# Altium schematic sheet esp32.SchDoc
size A4; SheetNumber: 1; SheetTotal: 5
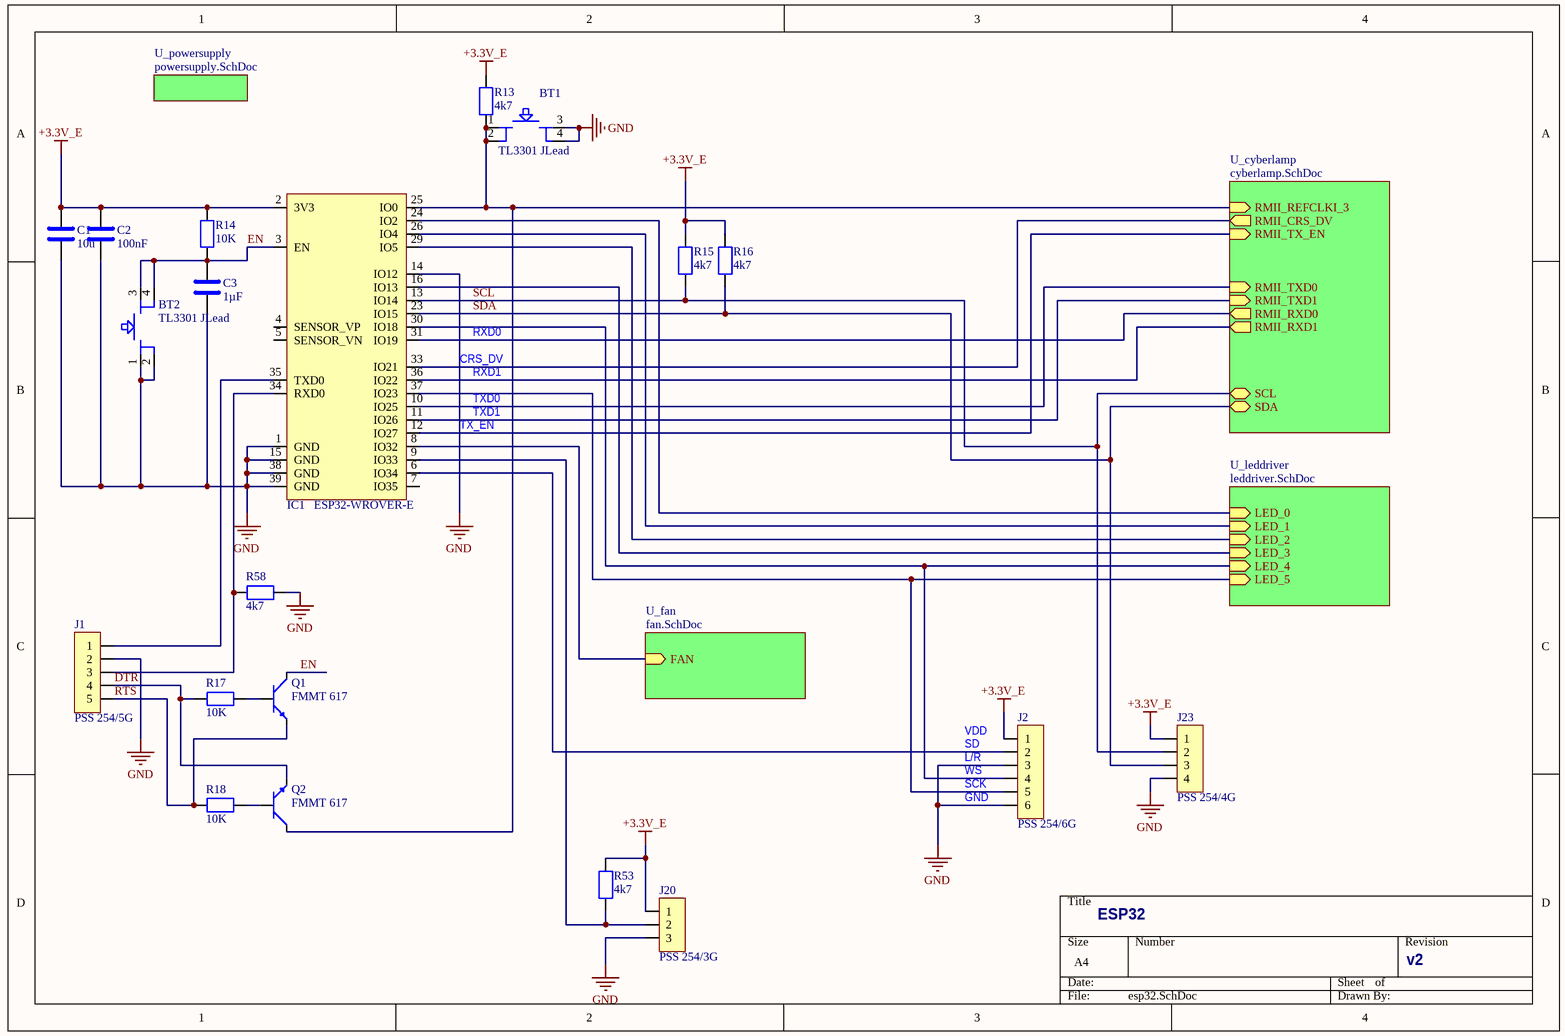
[diagram p0: esp32.SchDoc]

## Parts
BT1  TL3301 JLead  [TL3301_Jlead]
BT2  TL3301 JLead  [TL3301_Jlead]
C1  value 10u  [1210]  (hidden comment: 10uF 63V X7R 1210)
C2  value 100nF  [0603]  (hidden comment: 100nF 50V MLCC 0603)
C3  value 1µF  [0805]  (hidden comment: 1µF 25V MLCC 0805)
IC1  ESP32-WROVER-E  [ESP32-WROVER-I]
J1  PSS 254/5G  [PSS 5pol]
J2  PSS 254/6G  [PSS 6pol]
J20  PSS 254/3G  [PSS 3pol]
J23  PSS 254/4G  [PSS 4pol]
Q1  FMMT 617  [SOT-23]
Q2  FMMT 617  [SOT-23]
R13  value 4k7  [res0603]  (hidden comment: 4k7 100mW 0603)
R14  value 10K  [res0603]  (hidden comment: 10K 100mW 0603)
R15  value 4k7  [res0603]  (hidden comment: 4k7 100mW 0603)
R16  value 4k7  [res0603]  (hidden comment: 4k7 100mW 0603)
R17  value 10K  [res0603]  (hidden comment: 10K 100mW 0603)
R18  value 10K  [res0603]  (hidden comment: 10K 100mW 0603)
R53  value 4k7  [res0603]  (hidden comment: 4k7 100mW 0603)
R58  value 4k7  [res0603]  (hidden comment: 4k7 100mW 0603)

## Sub-sheets
U_cyberlamp = cyberlamp.SchDoc: RMII_REFCLKI_3 (in), RMII_TX_EN (in), RMII_TXD1 (in), RMII_TXD0 (in), RMII_CRS_DV (out), RMII_RXD1 (out), RMII_RXD0 (out), SCL (bidir), SDA (bidir)
U_fan = fan.SchDoc: FAN (in)
U_leddriver = leddriver.SchDoc: LED_0 (in), LED_1 (in), LED_2 (in), LED_3 (in), LED_4 (in), LED_5 (in)
U_powersupply = powersupply.SchDoc: no entries

## Nets
+3.3V_E: C1.1 C2.1 IC1.2(3V3) J2.1 J20.1 J23.1 R13.2 R14.2 R15.2 R16.2 R53.2
GND: BT1.3 BT1.4 BT2.1 BT2.2 C1.2 C2.2 C3.2 IC1.1(GND) IC1.14(IO12) IC1.15(GND) IC1.38(GND) IC1.39(GND) J1.2 J2.3 J2.6 J20.3 J23.4 R58.1
DTR: J1.4 Q2.2 R17.2
EN: BT2.3 BT2.4 C3.1 IC1.3(EN) Q1.3 R14.1
RTS: J1.5 Q1.2 R18.2
SCL: IC1.13(IO14) J23.2 R15.1 ; sheet U_cyberlamp/SCL
SDA: IC1.23(IO15) J23.3 R16.1 ; sheet U_cyberlamp/SDA
NetBT1_1: BT1.1 BT1.2 IC1.25(IO0) Q2.3 R13.1 ; sheet U_cyberlamp/RMII_REFCLKI_3
NetIC1_6: IC1.6(IO34) J2.2
NetIC1_8: IC1.8(IO32) ; sheet U_fan/FAN
NetIC1_9: IC1.9(IO33) J20.2 R53.1
NetIC1_10: IC1.10(IO25) ; sheet U_cyberlamp/RMII_TXD0
NetIC1_11: IC1.11(IO26) ; sheet U_cyberlamp/RMII_TXD1
NetIC1_12: IC1.12(IO27) ; sheet U_cyberlamp/RMII_TX_EN
NetIC1_16: IC1.16(IO13) ; sheet U_leddriver/LED_3
NetIC1_24: IC1.24(IO2) ; sheet U_leddriver/LED_0
NetIC1_26: IC1.26(IO4) ; sheet U_leddriver/LED_1
NetIC1_29: IC1.29(IO5) ; sheet U_leddriver/LED_2
NetIC1_30: IC1.30(IO18) J2.4 ; sheet U_leddriver/LED_4
NetIC1_31: IC1.31(IO19) ; sheet U_cyberlamp/RMII_RXD0
NetIC1_33: IC1.33(IO21) ; sheet U_cyberlamp/RMII_CRS_DV
NetIC1_34: IC1.34(RXD0) J1.3 R58.2
NetIC1_35: IC1.35(TXD0) J1.1
NetIC1_36: IC1.36(IO22) ; sheet U_cyberlamp/RMII_RXD1
NetIC1_37: IC1.37(IO23) J2.5 ; sheet U_leddriver/LED_5
NetQ1_1: Q1.1 R17.1
NetQ2_1: Q2.1 R18.1

Not connected (* = marked no-connect by the designer): IC1 4(SENSOR_VP) 5(SENSOR_VN) 7(IO35)

## Notes on the sheet
- (near IC1) CRS_DV
- RXD0
- RXD1
- (near IC1) TX_EN
- TXD0
- TXD1
- (near J2) VDD
- (near J2) SD
- (near J2) L/R
- (near J2) WS
- (near J2) SCK
- (near J2) GND
- ESP32
- v2

## Library data of the parts
BT1 BT2 = TK3301_jlead: TL3301 J-Lead button
C2 = 100nF 50V MLCC 0603: Reichelt code: X7R-G0603 100N; dielectricum: X7R; voltage: 50V; mouser code: 80-C0603X104K3R; storage: AIDTEKBox | Röhrchen; storageID: 18 | F7; lcsc code: C2252264
C3 = 1µF 25V MLCC 0805: Reichelt code: KEM X5R0805 1,0U; dielectricum: X5R; voltage: 25V; lcsc code: C35795; mouser code: 187-CL21B105KAFNFNE; storage: AIDETEK; storageID: 181
IC1 = ESP32-WROVER-E-N16R2: mouser code: 356-ESP32WRVREN16R2
J1 = PSS 254/5G: PSS 5pol wire-to-board-connector; reichelt code: PSS 254/5G
J2 = PSS 254/6G: PSS 6pol wire-to-board-connector; reichelt code: PSS 254/6G
J20 = PSS 254/3G: PSS 3pol wire-to-board-connector; reichelt code: PSS 254/3G
J23 = PSS 254/4G: PSS 4pol wire-to-board-connector; reichelt code: PSS 254/4G
Q1 Q2 = FMMT 617: NPN switching Transistor, 3A; reichelt code: FMMT 617 TA; mouser code: 522-FMMT617TA; storage: Box 1; storageID: 64
R14 R17 R18 = 10K 100mW 0603: Tolerance: 1%; Reichelt code: SMD-0603 10K; Power rating: 100mW; mouser code: 603-RE0603FRE0710KL; storage: AIDTEKBox; storageID: 4
C1 = 10uF 63V X7R 1210: mouser part: 81-GRM32ER71J106MA2L; voltage: 63V; lcsc code: C703129
R13 R15 R16 R53 R58 = 4k7 100mW 0603: mouser code: 603-RE0603FRE074K7L; Power rating: 100mW; storage: AIDTEKBox; storageID: 5